# Altium project Flashing_LED_23_9.PrjPcb
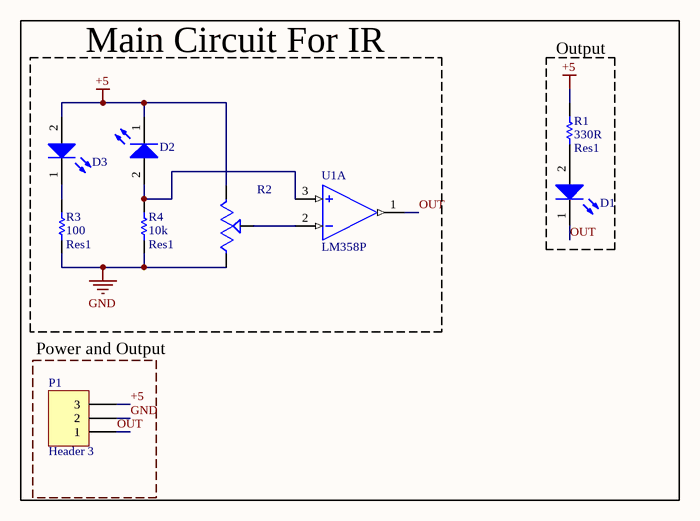
[diagram p0: Flashing_LED_23_9.SchDoc]
1 sheet, 9 parts. Net scope: global (net labels, ports and power ports of the same name join across sheets).
Board file: FLASHING_LED_23_9.PcbDoc

## Sheet Flashing_LED_23_9.SchDoc
size A; SheetNumber: 1; SheetTotal: 1

### Parts
D1  Infrared, 1.5V, 35°  [WL-TIRW_D3.9H5.3]  (value not drawn)
D2  Infrared, 1.5V, 35°  [WL-TIRW_D3.9H5.3]  (value not drawn)
D3  Infrared, 1.5V, 35°  [WL-TIRW_D3.9H5.3]  (value not drawn)
P1  Header 3  [HDR1X3]
R1  Res1  value 330R  [AXIAL-0.3]
R2  EVN-D8AA03B55  [TRIM_EVN-D8AA03B55]  (value not drawn)
R3  Res1  value 100  [AXIAL-0.3]
R4  Res1  value 10k  [AXIAL-0.3]
U1  LM358P  [DIP794W45P254L959H508Q8]  (part A of 3)

### Blocks framed on the sheet
Main Circuit For IR: D2 D3 R2-R4 U1
Output: D1 R1
Power and Output: P1

### Nets
+5: D2.1(K) D3.2(A) P1.3 R1.2 R2.3
GND: P1.2 R2.1 R3.1 R4.1
OUT: D1.1(K) P1.1 U1.1(OUT1)
NetD1_2: D1.2(A) R1.1
NetD2_2: D2.2(A) R4.2 U1.3(+IN1)
NetD3_1: D3.1(K) R3.2
NetR2_2: R2.2 U1.2(-IN1)

### Library data of the parts
D1-D3 = 15400385A3590: WL-TIRW THT Infrared Round Waterclear, D3.9 x H5.3mm, 60mW/sr, Infrared, 1.5V, 35°; Manufacturer: Wurth Elektronik; Centroid Wavelength: 845nm; Chip Technology: AlGaAs; Peak Wavelength: 850nm; Manufacturer Part Number: 15400385A3590; Category: Infrared LEDs; Match Code: WL-TIRW; ComponentLink1Description: Website Link; ComponentLink1URL: https://www.we-online.com/redexpert/article/15400385A3590?ad; ComponentLink2Description: Datasheet Link; ComponentLink2URL: https://www.we-online.com/redexpert/spec/15400385A3590?ad; Mount: Through Hole; Operating Temperature Max: 85°C; Operating Temperature Min: -40°C; Packaging: Bulk; Height: 5.3mm; Diameter: 3.9mm; Emitting Color: Infrared; Forward Voltage: 1.5V; Radiant Intensity: 60mW/sr; Viewing Angle: 35°
P1 = Header 3: Header, 3-Pin; LatestRevisionDate: 17-Jul-2002; LatestRevisionNote: Re-released for DXP Platform.; Publisher: Altium Limited
R1 R3 R4 = Res1: Resistor; Published: 8-Jun-2000; LatestRevisionDate: 17-Jul-2002; LatestRevisionNote: Re-released for DXP Platform.; PackageReference: AXIAL-0.3; Publisher: Altium Limited; PackageDescription: Axial Device, Thru-Hole; 2 Leads; 0.3 in Pin Spacing
R2 = EVN-D8AA03B55: 500 kOhms 0.1W, 1/10W PC Pins Through Hole Trimmer Potentiometer Carbon 1.0 Turn Top Adjustment; MF: Panasonic Electronic; SnapEDA_Link: https://www.snapeda.com/parts/EVN-D8AA03B55/Panasonic+Electronic+Components/view-part/?ref=snap; Package: PQFP-44 Panasonic; Value: *; MP: EVN-D8AA03B55; Check_prices: https://www.snapeda.com/parts/EVN-D8AA03B55/Panasonic+Electronic+Components/view-part/?ref=eda
U1 = LM358P: Dual, 30-V, 700-kHz operational amplifier; MF: Texas Instruments; SnapEDA_Link: https://www.snapeda.com/parts/LM358P/Texas+Instruments/view-part/?ref=snap; Package: PDIP-8 Texas; Value: *; MP: LM358P; Check_prices: https://www.snapeda.com/parts/LM358P/Texas+Instruments/view-part/?ref=eda